# Altium schematic sheet WiFi ESP-12E.SchDoc
size 209 x 297 mm; Author: Мурашкин Д.В.; Scale: 1:1; Letter1Column: Э
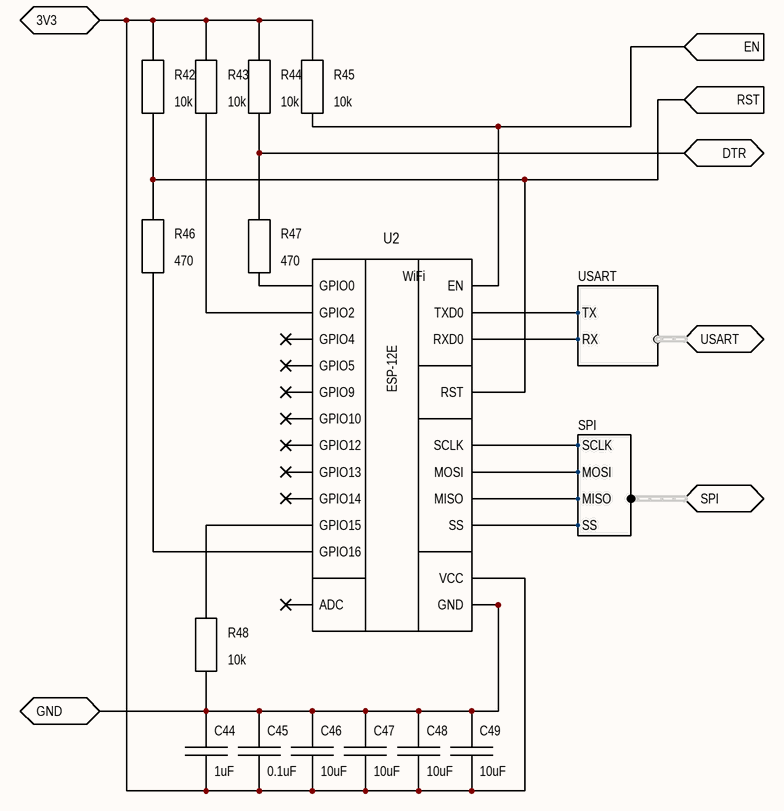
[diagram p0: WiFi ESP-12E.SchDoc]

## Parts
C44  1uF  [CAPC1608M]
C45  0.1uF  [CAPC1608M]
C46  10uF  [CAPC2012M]
C47  10uF  [CAPC2012M]
C48  10uF  [CAPC2012M]
C49  10uF  [CAPC2012M]
R42  10k  [RESC1608M]
R43  10k  [RESC1608M]
R44  10k  [RESC1608M]
R45  10k  [RESC1608M]
R46  470  [RESC1608M]
R47  470  [RESC1608M]
R48  10k  [RESC1608M]
U2  ESP-12E  [ESP-12E]

## Ports
3V3, DTR (bidir), EN (in), GND, RST (in), SPI (harness SPI), USART (harness USART)

## Harnesses
USART: TX, RX
SPI: MOSI, MISO, SCLK, SS

## Nets
3V3: C44.2 C45.2 C46.2 C47.2 C48.2 C49.2 R42.1 R43.1 R44.1 R45.1 U2.VCC ; port 3V3
DTR: R44.2 R47.1 ; port DTR
EN: R45.2 U2.EN ; port EN
GND: C44.1 C45.1 C46.1 C47.1 C48.1 C49.1 R48.2 U2.GND ; port GND
RST: R42.2 R46.1 U2.RST ; port RST
NetR43_2: R43.2 U2.GPIO2
NetR46_2: R46.2 U2.GPIO16
NetR47_2: R47.2 U2.GPIO0
NetR48_1: R48.1 U2.GPIO15
NetU2_CS0: U2.CS0(SS) ; port SPI.SS
NetU2_MISO: U2.MISO ; port SPI.MISO
NetU2_MOSI: U2.MOSI ; port SPI.MOSI
NetU2_RXD0: U2.RXD0 ; port USART.RX
NetU2_SCLK: U2.SCLK ; port SPI.SCLK
NetU2_TXD0: U2.TXD0 ; port USART.TX

Not connected (* = marked no-connect by the designer): U2 ADC* GPIO4* GPIO5* GPIO9* GPIO10* GPIO12* GPIO13* GPIO14*

## Notes on the sheet
- Перв. примен.
- Справ. №
- Подп. и дата
- Инв. № дубл.
- Взам. инв. №
- Разраб.
- Изм.
- Лист
- № докум.
- Подп.
- Дата
- Лит.
- Масса
- Масштаб
- Пров.
- Т.контр.
- Листов
- Инв. № подл.
- Утв.
- Н.контр.
- 2.106-A4
- Копировал
- Формат А4
- (in symbol ESP-12E) WiFi

## Library data of the parts
C44 = CC0603KRX5R6BB105: 1uF 10V 0603(1608); Manufacturer: Yageo; Group: Ceramic Capacitors; Temperature Coefficient: X5R; Tolerance: ±10%; Type: Ceramic; Part name: CC0603KRX5R6BB105; Voltage: 10V; Package: 0603 (1608); Value: 1uF; Operating Temperature: -55°C +85°C; Mounting Type: Surface Mount; Thickness: 0.90mm; Dimension: 1.60mm x 0.80mm
C45 = CC0603KRX7R7BB104: 0.1uF 16V 0603(1608); Manufacturer: Yageo; Group: Ceramic Capacitors; Temperature Coefficient: X7R; Tolerance: ±10%; Type: Ceramic; Part name: CC0603KRX7R7BB104; Voltage: 16V; Package: 0603 (1608); Value: 0.1uF; Operating Temperature: -55°C +125°C; Mounting Type: Surface Mount; Thickness: 0.90mm; Dimension: 1.60mm x 0.80mm
C46-C49 = CC0805MRX5R5BB106: 10uF 6.3V 0805(2012); Manufacturer: Yageo; Group: Ceramic Capacitors; Temperature Coefficient: X5R; Tolerance: ±20%; Type: Ceramic; Part name: CC0805MRX5R5BB106; Voltage: 6.3V; Package: 0805 (2012); Value: 10uF; Operating Temperature: -55°C +85°C; Mounting Type: Surface Mount; Thickness: 1.45mm; Dimension: 2.00mm x 1.25mm
R42-R45 R48 = RC0603JR-0710KL: 10k 0603(1608); Manufacturer: Yageo; Group: Ceramic Resistors; Temperature Coefficient: ±100ppm/°C; Tolerance: ±5%; Power: 0.1W; Part name: RC0603JR-0710KL; Type: Thin Film; Package: 0603 (1608); Value: 10k; Dimension: 1.60mm x 0.80mm; Thickness: 0.55mm; Operating Temperature: -55°C +155°C; Mounting Type: Surface mount
R46 R47 = RC0603JR-07470RL: 470 0603(1608); Manufacturer: Yageo; Group: Ceramic Resistors; Temperature Coefficient: ±100ppm/°C; Tolerance: ±5%; Power: 0.1W; Part name: RC0603JR-07470RL; Type: Thin Film; Package: 0603 (1608); Value: 470; Dimension: 1.60mm x 0.80mm; Thickness: 0.55mm; Operating Temperature: -55°C +155°C; Mounting Type: Surface mount
U2 = ESP-12E: WiFi Module based on ESP8266; Manufacturer: Espressif; Group: Wireless; Package: ESP-12E; Part name: ESP-12E